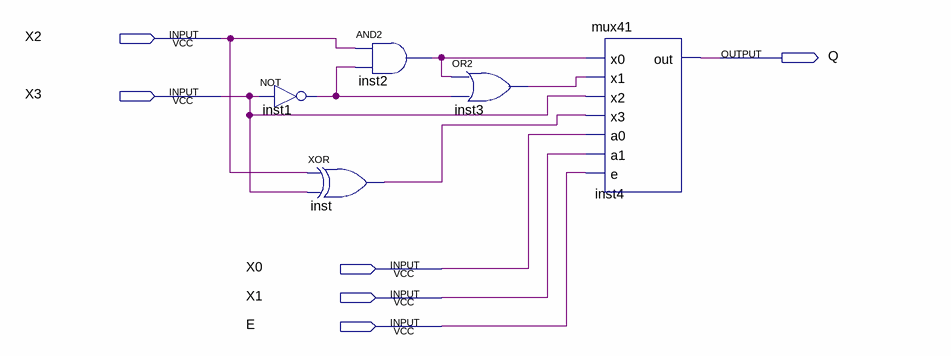
[diagram p0: schematic sheet]
// Quartus schematic xormux.bdf as structural Verilog: 5 symbols, 6 pins
module xormux (
  input  X2,
  input  X3,
  input  X0,
  input  X1,
  input  E,
  output Q
);

  wire inst1_out, inst2_out, inst3_out, inst_out;

  not inst1 (inst1_out, X3);
  and inst2 (inst2_out, X2, inst1_out);
  xor inst (inst_out, X2, X3);
  or inst3 (inst3_out, inst2_out, inst1_out);
  mux41 inst4 (.x0(inst2_out), .x1(inst3_out), .x2(X3), .x3(inst_out), .a0(X0), .a1(X1), .e(E), .out(Q));
endmodule
